# EAGLE design addonv2 (EAGLE 6.6.0)
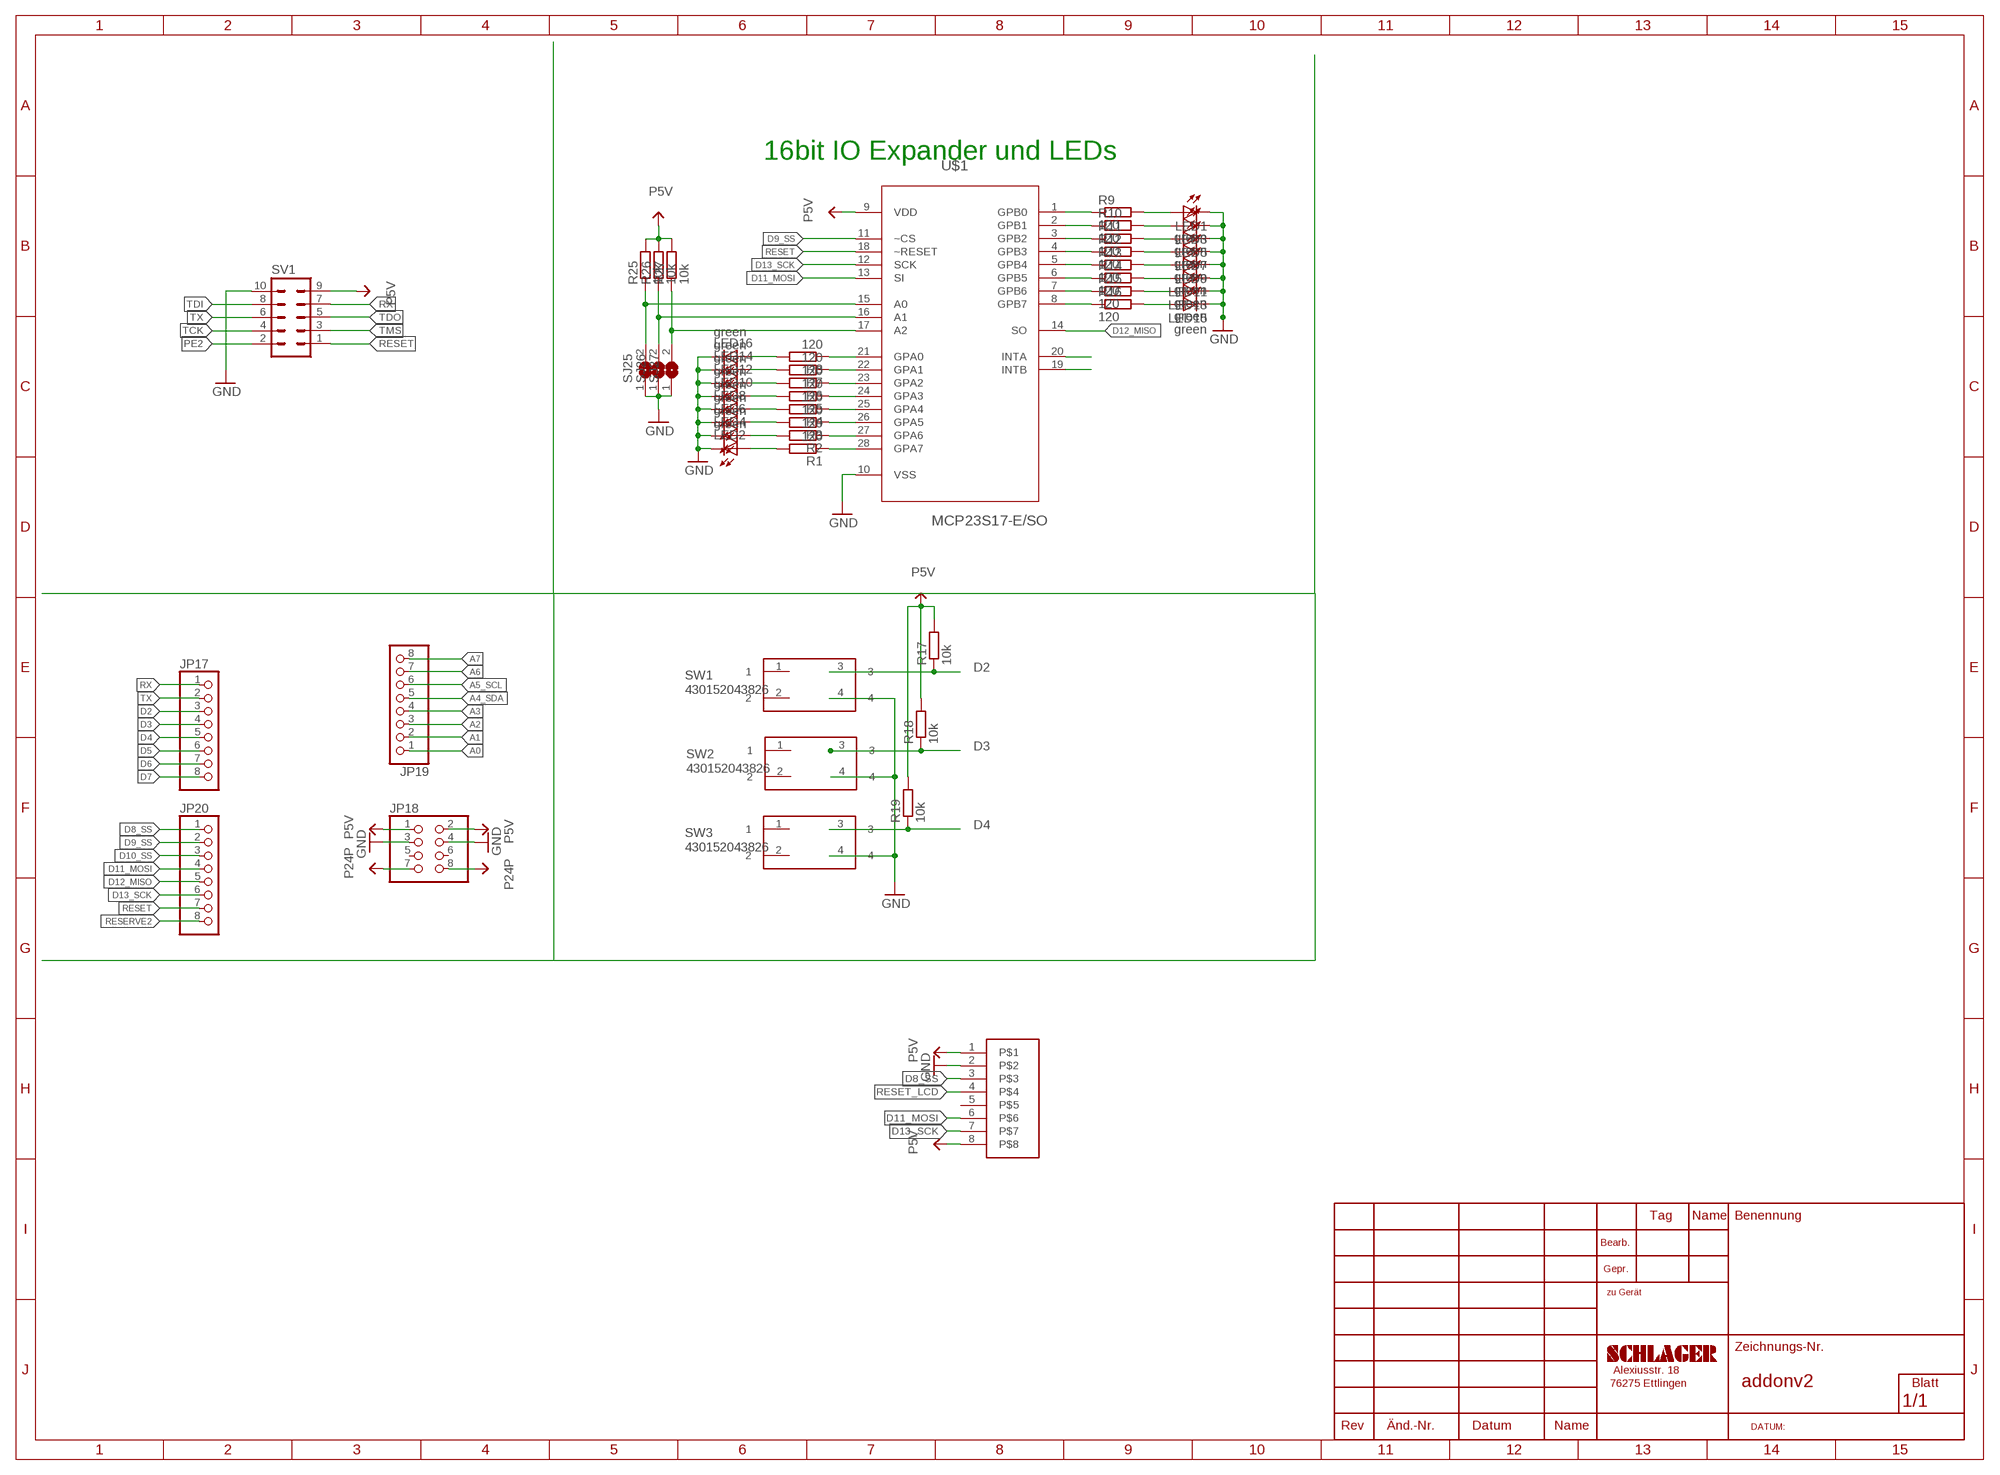
[diagram p0: schematic, sheet 1]

## Parts
JP17  PINHD-1X8  [1X08]
JP18  PINHD-2X4  [2X04]
JP19  PINHD-1X8  [1X08]
JP20  PINHD-1X8  [1X08]
LED1  green  LEDCHIPLED_0805  [CHIPLED_0805]
LED2  green  LEDCHIPLED_0805  [CHIPLED_0805]
LED3  green  LEDCHIPLED_0805  [CHIPLED_0805]
LED4  green  LEDCHIPLED_0805  [CHIPLED_0805]
LED5  green  LEDCHIPLED_0805  [CHIPLED_0805]
LED6  green  LEDCHIPLED_0805  [CHIPLED_0805]
LED7  green  LEDCHIPLED_0805  [CHIPLED_0805]
LED8  green  LEDCHIPLED_0805  [CHIPLED_0805]
LED9  green  LEDCHIPLED_0805  [CHIPLED_0805]
LED10  green  LEDCHIPLED_0805  [CHIPLED_0805]
LED11  green  LEDCHIPLED_0805  [CHIPLED_0805]
LED12  green  LEDCHIPLED_0805  [CHIPLED_0805]
LED13  green  LEDCHIPLED_0805  [CHIPLED_0805]
LED14  green  LEDCHIPLED_0805  [CHIPLED_0805]
LED15  green  LEDCHIPLED_0805  [CHIPLED_0805]
LED16  green  LEDCHIPLED_0805  [CHIPLED_0805]
R1  120  R-EU_R0805  [R0805]
R2  120  R-EU_R0805  [R0805]
R3  120  R-EU_R0805  [R0805]
R4  120  R-EU_R0805  [R0805]
R5  120  R-EU_R0805  [R0805]
R6  120  R-EU_R0805  [R0805]
R7  120  R-EU_R0805  [R0805]
R8  120  R-EU_R0805  [R0805]
R9  120  R-EU_R0805  [R0805]
R10  120  R-EU_R0805  [R0805]
R11  120  R-EU_R0805  [R0805]
R12  120  R-EU_R0805  [R0805]
R13  120  R-EU_R0805  [R0805]
R14  120  R-EU_R0805  [R0805]
R15  120  R-EU_R0805  [R0805]
R16  120  R-EU_R0805  [R0805]
R17  10k  R-EU_R0805  [R0805]
R18  10k  R-EU_R0805  [R0805]
R19  10k  R-EU_R0805  [R0805]
R25  10k  R-EU_R0805  [R0805]
R26  10k  R-EU_R0805  [R0805]
R27  10k  R-EU_R0805  [R0805]
SJ25  SJN  [SJ]
SJ26  SJN  [SJ]
SJ27  SJN  [SJ]
SV1  ML10L  [ML10L]
SW1  430152043826  [430152043826]
SW2  430152043826  [430152043826]
SW3  430152043826  [430152043826]
U$1  MCP23S17-E/SO  [SOIC127P030X265-28N]
U$3  1.44-128X128  [1.44-128X128]

## Nets
A0: JP19.1
A1: JP19.2
A2: JP19.3
A3: JP19.4
A4_SDA: JP19.5
A5_SCL: JP19.6
A6: JP19.7
A7: JP19.8
D2: JP17.3 R17.1 SW1.3
D3: JP17.4 R18.1 SW2.3
D4: JP17.5 R19.1 SW3.3
D5: JP17.6
D6: JP17.7
D7: JP17.8
D8_SS: JP20.1 U$3.3
D9_SS: JP20.2 U$1.11(~CS)
D10_SS: JP20.3
D11_MOSI: JP20.4 U$1.13(SI) U$3.6
D12_MISO: JP20.5 U$1.14(SO)
D13_SCK: JP20.6 U$1.12(SCK) U$3.7
GND: JP18.3 JP18.4 LED1.C LED2.C LED3.C LED4.C LED5.C LED6.C LED7.C LED8.C LED9.C LED10.C LED11.C LED12.C LED13.C LED14.C LED15.C LED16.C SJ25.1 SJ26.1 SJ27.1 SV1.10 SW1.4 SW2.4 SW3.4 U$1.10(VSS) U$3.2
N$1: LED1.A R9.2
N$2: LED3.A R10.2
N$3: LED5.A R11.2
N$4: LED7.A R12.2
N$5: LED9.A R13.2
N$6: LED11.A R14.2
N$7: LED13.A R15.2
N$8: LED15.A R16.2
N$9: R9.1 U$1.1(GPB0)
N$10: R10.1 U$1.2(GPB1)
N$11: R11.1 U$1.3(GPB2)
N$12: R12.1 U$1.4(GPB3)
N$13: R13.1 U$1.5(GPB4)
N$14: R14.1 U$1.6(GPB5)
N$15: R15.1 U$1.7(GPB6)
N$16: R16.1 U$1.8(GPB7)
N$17: LED2.A R1.2
N$18: LED4.A R2.2
N$19: LED6.A R3.2
N$20: LED8.A R4.2
N$21: LED10.A R5.2
N$22: LED12.A R6.2
N$23: LED14.A R7.2
N$24: LED16.A R8.2
N$25: R1.1 U$1.28(GPA7)
N$26: R2.1 U$1.27(GPA6)
N$27: R3.1 U$1.26(GPA5)
N$28: R4.1 U$1.25(GPA4)
N$29: R5.1 U$1.24(GPA3)
N$30: R6.1 U$1.23(GPA2)
N$31: R7.1 U$1.22(GPA1)
N$32: R8.1 U$1.21(GPA0)
N$33: U$1.20(INTA)
N$34: U$1.19(INTB)
N$38: R25.1 SJ25.2 U$1.15(A0)
N$39: R26.1 SJ26.2 U$1.16(A1)
N$40: R27.1 SJ27.2 U$1.17(A2)
P5V: JP18.1 JP18.2 R17.2 R18.2 R19.2 R25.2 R26.2 R27.2 SV1.9 U$1.9(VDD) U$3.1 U$3.8
P24P: JP18.7 JP18.8
PE2: SV1.2
RESERVE2: JP20.8
RESET: JP20.7 SV1.1 U$1.18(~RESET)
RESET_LCD: U$3.4
RX: JP17.1 SV1.7
TCK: SV1.4
TDI: SV1.8
TDO: SV1.5
TMS: SV1.3
TX: JP17.2 SV1.6
Unconnected: JP18.5 JP18.6 SW1.1 SW1.2 SW2.1 SW2.2 SW3.1 SW3.2 U$3.5

## Notes on the sheet
- 16bit IO Expander und LEDs

## Library data of the parts
JP17 JP19 JP20 = pinhead:PINHD-1X8: PIN HEADER
JP18 = pinhead:PINHD-2X4: PIN HEADER
LED1-LED16 = led:LED: LED OSRAM: - CHIPLED LG R971, LG N971, LY N971, LG Q971, LY Q971, LO R971, LY R971 LH N974, LH R974 LS Q976, LO Q976, LY Q976 LO Q996 - Hyper CHIPLED LW Q18S LB Q993, LB Q99A, LB R99A - SideLED LS A670, LO A670, LY A670, LG A670, LP A670 LB A673, LV A673, LT A673, LW A673 LH A674 LY A675 LS A676, LA A676, LO A676, LY A676, LW A676 LS A679, LY A679, LG A679 - Hyper Micro SIDELED® LS Y876, LA Y876, LO Y876, LY Y876 LT Y87S - SmartLED LW L88C, LW L88S LB L89C, LB L89S, LG L890 LS L89K, LO L89K, LY L89K LS L896, LA L896, LO L896, LY L896 - TOPLED LS T670, LO T670, LY T670, LG T670, LP T670 LSG T670, LSP T670, LSY T670, LOP T670, LYG T670 LG T671, LOG T671, LSG T671 LB T673, LV T673, LT T673, LW T673 LH T674 LS T676, LA T676, LO T676, LY T676, LB T676, LH T676, LSB T676, LW T676 LB T67C, LV T67C, LT T67C, LS T67K, LO T67K, LY T67K, LW E67C LS E67B, LA E67B, LO E67B, LY E67B, LB E67C, LV E67C, LT E67C LW T67C LS T679, LY T679, LG T679 LS T770, LO T770, LY T770, LG T770, LP T770 LB T773, LV T773, LT T773, LW T773 LH T774 LS E675, LA E675, LY E675, LS T675 LS T776, LA T776, LO T776, LY T776, LB T776 LHGB T686 LT T68C, LB T68C - Hyper Mini TOPLED® LB M676 - Mini TOPLED Santana® LG M470 LS M47K, LO M47K, LY M47K Source: http://www.osram.convergy.de LUXEON: - LUMILED® LXK2-PW12-R00, LXK2-PW12-S00, LXK2-PW14-U00, LXK2-PW14-V00 LXK2-PM12-R00, LXK2-PM12-S00, LXK2-PM14-U00 LXK2-PE12-Q00, LXK2-PE12-R00, LXK2-PE12-S00, LXK2-PE14-T00, LXK2-PE14-U00 LXK2-PB12-K00, LXK2-PB12-L00, LXK2-PB12-M00, LXK2-PB14-N00, LXK2-PB14-P00, LXK2-PB14-Q00 LXK2-PR12-L00, LXK2-PR12-M00, LXK2-PR14-Q00, LXK2-PR14-R00 LXK2-PD12-Q00, LXK2-PD12-R00, LXK2-PD12-S00 LXK2-PH12-R00, LXK2-PH12-S00 LXK2-PL12-P00, LXK2-PL12-Q00, LXK2-PL12-R00 Source: www.luxeon.com KINGBRIGHT: KA-3528ASYC Source: www.kingbright.com
R1-R19 R25-R27 = rcl:R-EU_: RESISTOR, European symbol
SJ25-SJ27 = jumper:SJ: SMD solder JUMPER
SV1 = X_Pfostenstecker:ML10L: HARTING; OC_FARNELL: unknown; OC_NEWARK: unknown
SW1-SW3 = Wuerth_Elektronik_Switch:430152043826: WS-TSS-6x6 mm SMD Tact Switch,4 pins
U$1 = schlager_ics:MCP23S17-E/SO: 16-Bit I/O Expander; DESCRIPTION: IC I/O EXPANDER; MPN: MCP23S17-E/SO; OC_FARNELL: 1332093; OC_NEWARK: 31K2950; PACKAGE: SOIC-28; SUPPLIER: Microchip
U$3 = schlager_modules:1.44-128X128

## Net classes
4 USBpair: width 0.254 mm, drill 0.406 mm, clearance 0.508 mm

## Board
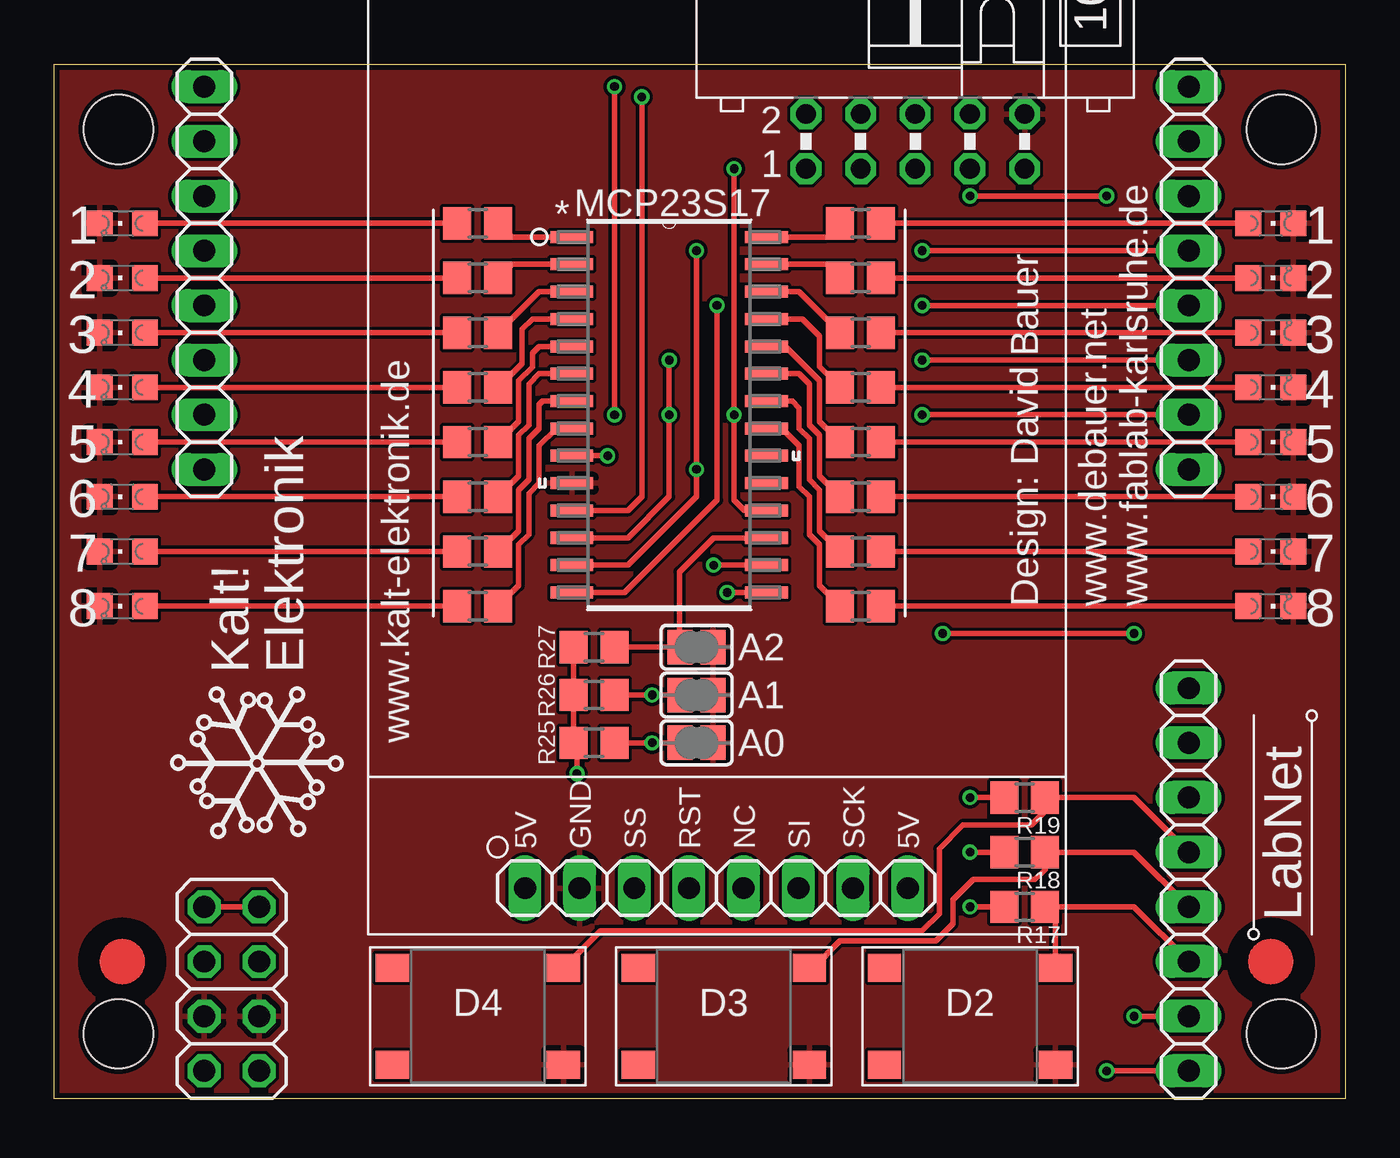
[diagram p1: board, top side]
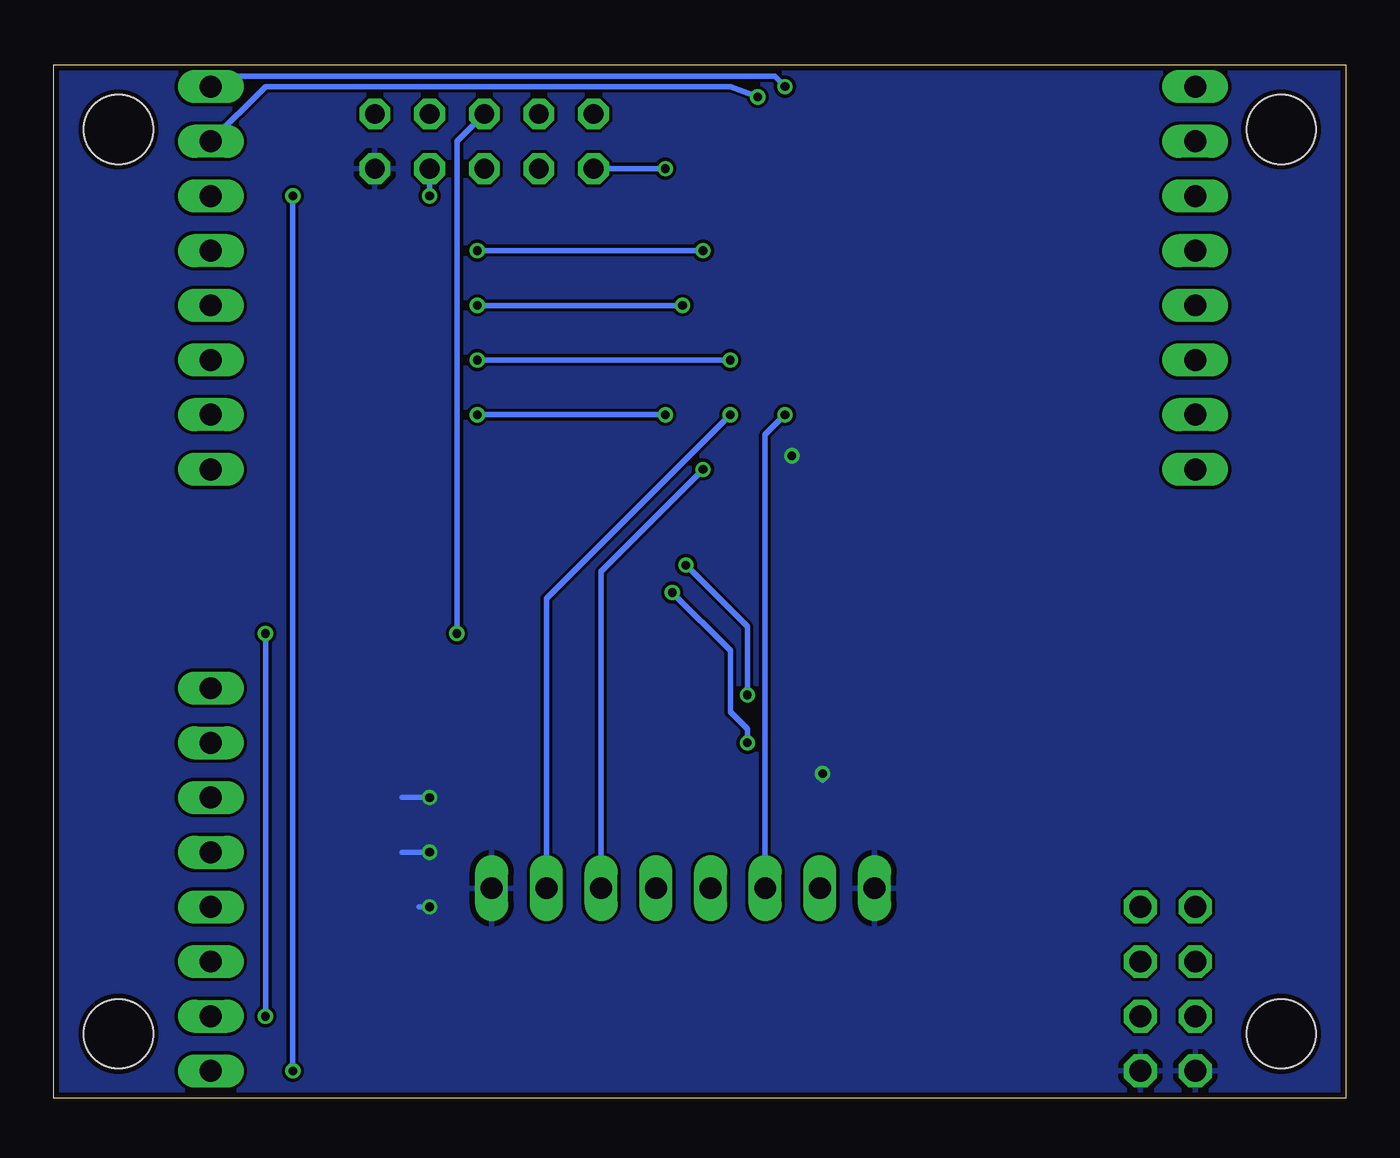
[diagram p2: board, bottom side, seen from below]

Size 60 x 48 mm. Coordinates in mm from the lower left corner, seen from the top.
Outline: 0,0 60,0 60,48 0,48 0,0
Copper layers (1*16): Top 0.035mm / dielectric 1.5mm / Bottom 0.035mm
Design rules "ITEADstudio_DRC": minimum track width 6mil, minimum drill 12mil, track to track 6mil, track to pad 6mil, pad to pad 6mil, via to via 6mil, smd to smd 0mil, copper to edge 10mil, drill to drill 10mil, minimum pad ring 10mil, minimum via ring 6mil, stop-mask expansion 2mil, vias tented up to drill 100mil, thermal gap 10mil
Holes 3.2 mm at 57,45 57,3 3,45 3,3

### Footprints (pad centres in the part's own frame; a part is rotated, then mirrored left to right if it is on the bottom)
1X08 = drill 1.016 long: 1 -8.89,0; 2 -6.35,0; 3 -3.81,0; 4 -1.27,0; 5 1.27,0; 6 3.81,0; 7 6.35,0; 8 8.89,0
2X04 = drill 1.016 octagon: 1 -3.81,-1.27; 2 -3.81,1.27; 3 -1.27,-1.27; 4 -1.27,1.27; 5 1.27,-1.27; 6 1.27,1.27; 7 3.81,-1.27; 8 3.81,1.27
CHIPLED_0805 = smd 1.2 x 1.2: A 0,-1.05; C 0,1.05
R0805 = smd 1.3 x 1.5: 1 -0.95,0; 2 0.95,0
SJ = smd 1.168 x 1.6: 1 -0.762,0; 2 0.762,0
ML10L = drill 0.914 octagon: 1 -5.08,-1.27; 2 -5.08,1.27; 3 -2.54,-1.27; 4 -2.54,1.27; 5 0,-1.27; 6 0,1.27; 7 2.54,-1.27; 8 2.54,1.27; 9 5.08,-1.27; 10 5.08,1.27
430152043826 = smd 1.55 x 1.3: 1 -3.975,2.25; 2 -3.975,-2.25; 3 3.975,2.25; 4 3.975,-2.25
SOIC127P030X265-28N = smd 1.981 x 0.559: 1 -4.521,8.255; 2 -4.521,6.985; 3 -4.521,5.715; 4 -4.521,4.445; 5 -4.521,3.175; 6 -4.521,1.905; 7 -4.521,0.635; 8 -4.521,-0.635; 9 -4.521,-1.905; 10 -4.521,-3.175; 11 -4.521,-4.445; 12 -4.521,-5.715; 13 -4.521,-6.985; 14 -4.521,-8.255; 15 4.521,-8.255; 16 4.521,-6.985; 17 4.521,-5.715; 18 4.521,-4.445; 19 4.521,-3.175; 20 4.521,-1.905; 21 4.521,-0.635; 22 4.521,0.635; 23 4.521,1.905; 24 4.521,3.175; 25 4.521,4.445; 26 4.521,5.715; 27 4.521,6.985; 28 4.521,8.255
1.44-128X128 = drill 1.016 long: 1 7.27,2.14; 2 9.81,2.14; 3 12.35,2.14; 4 14.89,2.14; 5 17.43,2.14; 6 19.97,2.14; 7 22.51,2.14; 8 25.05,2.14

### Placement (x,y rotation side)
JP17  52.71,10.16 90 top
JP18  8.26,5.08 90 top
JP19  6.99,38.1 270 top
JP20  52.71,38.1 270 top
LED1  3.18,40.64 90 top
LED2  56.52,40.64 270 top
LED3  3.18,38.1 90 top
LED4  56.52,38.1 270 top
LED5  3.18,35.56 90 top
LED6  56.52,35.56 270 top
LED7  3.18,33.02 90 top
LED8  56.52,33.02 270 top
LED9  3.18,30.48 90 top
LED10  56.52,30.48 270 top
LED11  3.18,27.94 90 top
LED12  56.52,27.94 270 top
LED13  3.18,25.4 90 top
LED14  56.52,25.4 270 top
LED15  3.18,22.86 90 top
LED16  56.52,22.86 270 top
R1  37.47,40.64 0 top
R2  37.47,38.1 0 top
R3  37.47,35.56 0 top
R4  37.47,33.02 0 top
R5  37.47,30.48 0 top
R6  37.47,27.94 0 top
R7  37.47,25.4 0 top
R8  37.47,22.86 0 top
R9  19.69,40.64 180 top
R10  19.69,38.1 180 top
R11  19.69,35.56 180 top
R12  19.69,33.02 180 top
R13  19.69,30.48 180 top
R14  19.69,27.94 180 top
R15  19.69,25.4 180 top
R16  19.69,22.86 180 top
R17  45.09,8.89 180 top
R18  45.09,11.43 180 top
R19  45.09,13.97 180 top
R25  25.09,16.51 180 top
R26  25.09,18.73 180 top
R27  25.09,20.95 180 top
SJ25  29.85,16.51 180 top
SJ26  29.85,18.73 180 top
SJ27  29.85,20.95 180 top
SV1  40.01,44.45 0 top
SW1  42.55,3.81 0 top
SW2  31.12,3.81 0 top
SW3  19.69,3.81 0 top
U$1  28.58,31.75 0 top
U$2  [LABNET]  57.79,12.7 90 top
U$3  14.61,7.62 0 top
U$4  [KALT!ELEKTRONIK]  9.53,22.86 90 top
U$5  [PASSMARK]  3.18,6.35 0 top
U$7  [PASSMARK]  56.52,6.35 0 top

### Tracks (layer width: path | path; a pad name or v marks a point on that pad's centre or on a via)
D2
  Top 0.254: JP17.3 50.17,8.89 R17.1 46.53,8.4 SW1.3
D3
  Top 0.254: JP17.4 50.17,11.43 R18.1 46.04,10.64 45.57,10.16 42.71,10.16 41.76,9.21 41.76,8.1 40.96,7.3 36.52,7.3 35.28,6.06 SW2.3
D4
  Top 0.254: JP17.5 50.17,13.97 R19.1 46.04,13.33 45.41,12.7 42.23,12.7 41.12,11.59 41.12,8.57 40.33,7.78 25.38,7.78 SW3.3
D8_SS  (via drill 0.4)
  Top 0.254: v26.04,31.75 v26.04,46.99
  Bottom 0.254: v26.04,31.75 26.96,30.83 U$3.3 | v26.04,46.99 26.52,47.47 52.23,47.47 JP20.1
D9_SS  (via drill 0.4)
  Top 0.254: U$1.11 26.67,27.3 27.31,27.94 v27.31,46.51
  Bottom 0.254: v27.31,46.51 28.58,46.99 50.17,46.99 JP20.2
D11_MOSI  (via drill 0.4)
  Top 0.254: U$1.13 26.67,24.77 29.85,27.94 v29.85,29.21 v29.85,39.37 | v40.33,39.37 JP20.4
  Bottom 0.254: v29.85,39.37 v40.33,39.37 | U$3.6 34.58,24.48 v29.85,29.21
D12_MISO  (via drill 0.4)
  Top 0.254: U$1.14 26.52,23.5 30.8,27.78 v30.8,36.83 | v40.33,36.83 JP20.5
  Bottom 0.254: v30.8,36.83 v40.33,36.83
D13_SCK  (via drill 0.4)
  Top 0.254: U$1.12 26.67,26.04 28.58,27.94 v28.58,31.75 v28.58,34.29 | v40.33,34.29 JP20.6
  Bottom 0.254: v28.58,34.29 v40.33,34.29 | U$3.7 37.12,23.21 v28.58,31.75
GND
  pour Top (rank 5): -86.2,68.58 67.95,68.58 67.95,-30.48 -86.51,-30.32
N$1
  Top 0.254: R9.2 LED1.A
N$2
  Top 0.254: R10.2 LED3.A
N$3
  Top 0.254: LED5.A R11.2
N$4
  Top 0.254: LED7.A R12.2
N$5
  Top 0.254: R13.2 LED9.A
N$6
  Top 0.254: R14.2 LED11.A
N$7
  Top 0.254: R15.2 LED13.A
N$8
  Top 0.254: R16.2 LED15.A
N$9
  Top 0.254: U$1.1 21.27,40.01 R9.1
N$10
  Top 0.254: U$1.2 21.27,38.73 R10.1
N$11
  Top 0.254: U$1.3 22.55,37.47 R11.1
N$12
  Top 0.254: U$1.4 22.23,36.2 21.75,35.72 21.75,34.13 R12.1
N$13
  Top 0.254: U$1.5 22.55,34.92 22.23,34.61 22.23,33.97 21.59,33.34 21.59,31.43 R13.1
N$14
  Top 0.254: U$1.6 22.55,33.66 22.07,33.18 22.07,31.27 21.59,30.8 21.59,28.89 R14.1
N$15
  Top 0.254: U$1.7 22.71,32.38 22.55,32.23 22.55,31.11 22.07,30.64 22.07,28.73 21.59,28.26 21.59,26.36 R15.1
N$16
  Top 0.254: U$1.8 23.34,31.11 22.55,30.32 22.55,28.57 22.07,28.1 22.07,26.19 21.59,25.72 21.59,23.82 R16.1
N$17
  Top 0.254: R1.2 LED2.A
N$18
  Top 0.254: LED4.A R2.2
N$19
  Top 0.254: R3.2 LED6.A
N$20
  Top 0.254: LED8.A R4.2
N$21
  Top 0.254: R5.2 LED10.A
N$22
  Top 0.254: LED12.A R6.2
N$23
  Top 0.254: R7.2 LED14.A
N$24
  Top 0.254: LED16.A R8.2
N$25
  Top 0.254: U$1.28 35.89,40.01 R1.1
N$26
  Top 0.254: U$1.27 35.89,38.73 R2.1
N$27
  Top 0.254: U$1.26 34.61,37.47 R3.1
N$28
  Top 0.254: U$1.25 34.77,36.2 35.56,35.4 35.56,33.98 R4.1
N$29
  Top 0.254: U$1.24 33.98,34.92 35.56,33.34 35.56,31.43 R5.1
N$30
  Top 0.254: U$1.23 34.61,33.66 35.09,33.18 35.09,31.27 35.56,30.8 35.56,28.89 R6.1
N$31
  Top 0.254: U$1.22 34.3,32.38 34.61,32.07 34.61,31.11 35.09,30.64 35.09,28.73 35.56,28.26 35.56,26.36 R7.1
N$32
  Top 0.254: U$1.21 33.82,31.11 34.61,30.32 34.61,28.42 35.09,27.94 35.09,26.19 35.56,25.72 35.56,23.82 R8.1
N$38  (via drill 0.4)
  Top 0.254: R25.1 v27.79,16.51 SJ25.2 | v31.28,23.5 U$1.15
  Bottom 0.254: v27.79,16.51 27.79,17.14 28.58,17.94 28.58,20.8 v31.28,23.5
N$39  (via drill 0.4)
  Top 0.254: R26.1 v27.79,18.73 SJ26.2 | v30.64,24.77 U$1.16
  Bottom 0.254: v27.79,18.73 27.79,21.91 v30.64,24.77
N$40
  Top 0.254: R27.1 SJ27.2 29.06,20.99 29.06,24.45 30.64,26.04 U$1.17
P5V  (via drill 0.4)
  Top 0.254: U$1.9 v25.72,29.84 | R17.2 v42.55,8.89 | R18.2 v42.55,11.43 | R19.2 v42.55,13.97 | R27.2 R26.2 R25.2 24.29,16.51 v24.29,15.08
  Bottom 0.254: v42.55,8.89 43.03,8.89 | v42.55,11.43 43.82,11.43 | v42.55,13.97 43.82,13.97 | v24.29,15.08 24.29,14.76
  pour Bottom: -89.53,71.12 79.38,71.12 79.38,-38.1 -88.26,-39.37
P24P
  Top 0.254: JP18.8 JP18.7
RESET  (via drill 0.4)
  Top 0.254: JP20.7 v40.33,31.75 | U$1.18 32.07,27.3 31.6,27.78 v31.6,31.75 v31.6,43.18
  Bottom 0.254: v40.33,31.75 v31.6,31.75 | v31.6,43.18 SV1.1
RX  (via drill 0.4)
  Top 0.254: JP17.1 v48.9,1.27 | v48.9,41.91 v42.55,41.91
  Bottom 0.254: v48.9,1.27 v48.9,41.91 | v42.55,41.91 SV1.7
TX  (via drill 0.4)
  Top 0.254: v41.28,21.59 v50.17,21.59 | v50.17,3.81 JP17.2
  Bottom 0.254: SV1.6 41.28,44.45 v41.28,21.59 | v50.17,21.59 v50.17,3.81

### Text on the board
tPlace: MCP23S17 | 1 | 1 | 2 | 2 | 3 | 3 | 4 | 4 | 5 | 5 | 6 | 6 | 7 | 7 | Design: David Bauer | www.debauer.net | www.fablab-karlsruhe.de | 8 | 8 | A2 | A1 | www.kalt-elektronik.de | A0 | 5V | GND | SS | RST | NC | SI | SCK | 5V | D4 | D3 | D2